# Altium schematic sheet Powerboard_Conector_1.SchDoc
size A4; CompanyName: Technische Hochschule Nürnberg Georg Simon Ohm; Organization: UltraZohm; Address1: Kesslerplatz 12; Address2: 90489 Nürnberg; Address3: GERMANY; DocumentNumber: 5; SheetNumber: 5; SheetTotal: 6; Website: www.ultrazohm.com
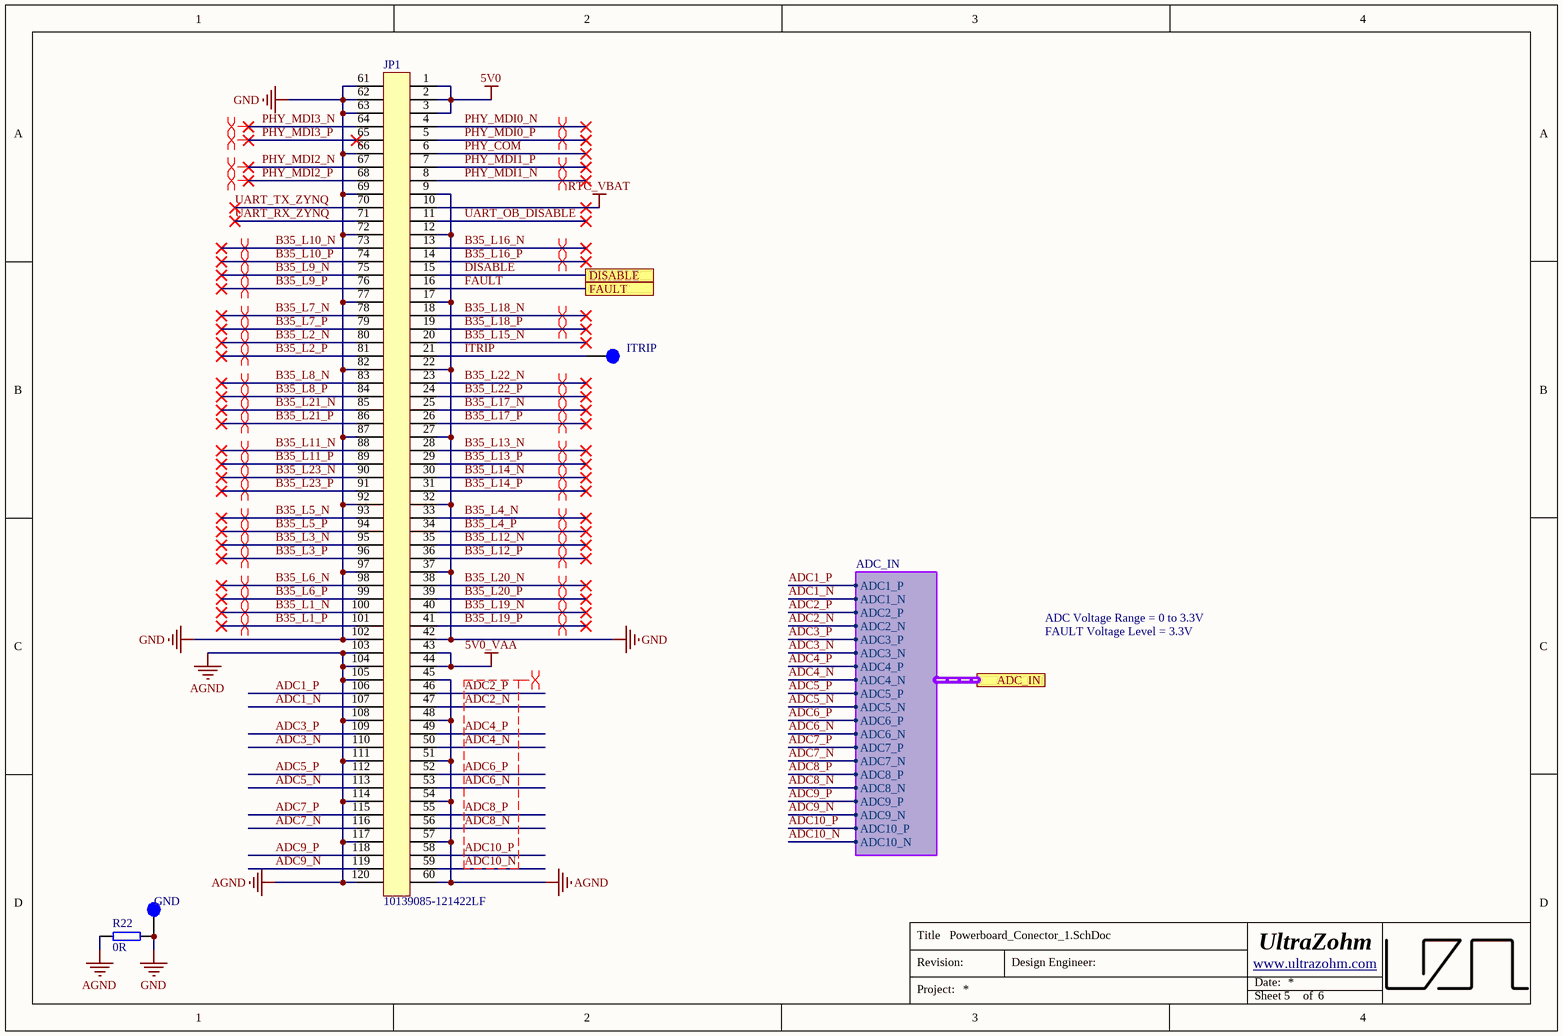
[diagram p0: Powerboard_Conector_1.SchDoc]

## Parts
GND  GND  [TP_1mm]  (value not drawn)  (no BOM)
ITRIP  ITRIP  [TP_1mm]  (value not drawn)  (no BOM)
JP1  10139085-121422LF  [10139085-121422LF]
R22  0R  [RESC1608X06N]

## Ports
ADC_IN (harness ADC_IN), DISABLE, FAULT

## Harnesses
ADC_IN: ADC1_P, ADC2_P, ADC3_P, ADC4_P, ADC5_P, ADC6_P, ADC7_P, ADC8_P, ADC9_P, ADC1_N, ADC2_N, ADC3_N, ADC4_N, ADC5_N, ADC6_N, ADC7_N, ADC8_N, ADC9_N, ADC10_P, ADC10_N

## Nets
5V0: JP1.1 JP1.2 JP1.3
5V0_VAA: JP1.43 JP1.44
AGND: JP1.45 JP1.48 JP1.51 JP1.54 JP1.57 JP1.60 JP1.103 JP1.104 JP1.105 JP1.108 JP1.111 JP1.114 JP1.117 JP1.120 R22.2
GND: GND.1 JP1.9 JP1.12 JP1.17 JP1.22 JP1.27 JP1.32 JP1.37 JP1.42 JP1.61 JP1.62 JP1.63 JP1.66 JP1.69 JP1.72 JP1.77 JP1.82 JP1.87 JP1.92 JP1.97 JP1.102 R22.1
RTC_VBAT: JP1.10
ADC1_N: JP1.107 ; port ADC_IN.ADC1_N
ADC1_P: JP1.106 ; port ADC_IN.ADC1_P
ADC2_N: JP1.47 ; port ADC_IN.ADC2_N
ADC2_P: JP1.46 ; port ADC_IN.ADC2_P
ADC3_N: JP1.110 ; port ADC_IN.ADC3_N
ADC3_P: JP1.109 ; port ADC_IN.ADC3_P
ADC4_N: JP1.50 ; port ADC_IN.ADC4_N
ADC4_P: JP1.49 ; port ADC_IN.ADC4_P
ADC5_N: JP1.113 ; port ADC_IN.ADC5_N
ADC5_P: JP1.112 ; port ADC_IN.ADC5_P
ADC6_N: JP1.53 ; port ADC_IN.ADC6_N
ADC6_P: JP1.52 ; port ADC_IN.ADC6_P
ADC7_N: JP1.116 ; port ADC_IN.ADC7_N
ADC7_P: JP1.115 ; port ADC_IN.ADC7_P
ADC8_N: JP1.56 ; port ADC_IN.ADC8_N
ADC8_P: JP1.55 ; port ADC_IN.ADC8_P
ADC9_N: JP1.119 ; port ADC_IN.ADC9_N
ADC9_P: JP1.118 ; port ADC_IN.ADC9_P
ADC10_N: JP1.59 ; port ADC_IN.ADC10_N
ADC10_P: JP1.58 ; port ADC_IN.ADC10_P
B35_L1_N: JP1.100
B35_L1_P: JP1.101
B35_L2_N: JP1.80
B35_L2_P: JP1.81
B35_L3_N: JP1.95
B35_L3_P: JP1.96
B35_L4_N: JP1.33
B35_L4_P: JP1.34
B35_L5_N: JP1.93
B35_L5_P: JP1.94
B35_L6_N: JP1.98
B35_L6_P: JP1.99
B35_L7_N: JP1.78
B35_L7_P: JP1.79
B35_L8_N: JP1.83
B35_L8_P: JP1.84
B35_L9_N: JP1.75
B35_L9_P: JP1.76
B35_L10_N: JP1.73
B35_L10_P: JP1.74
B35_L11_N: JP1.88
B35_L11_P: JP1.89
B35_L12_N: JP1.35
B35_L12_P: JP1.36
B35_L13_N: JP1.28
B35_L13_P: JP1.29
B35_L14_N: JP1.30
B35_L14_P: JP1.31
B35_L15_N: JP1.20
B35_L16_N: JP1.13
B35_L16_P: JP1.14
B35_L17_N: JP1.25
B35_L17_P: JP1.26
B35_L18_N: JP1.18
B35_L18_P: JP1.19
B35_L19_N: JP1.40
B35_L19_P: JP1.41
B35_L20_N: JP1.38
B35_L20_P: JP1.39
B35_L21_N: JP1.85
B35_L21_P: JP1.86
B35_L22_N: JP1.23
B35_L22_P: JP1.24
B35_L23_N: JP1.90
B35_L23_P: JP1.91
DISABLE: JP1.15 ; port DISABLE
FAULT: JP1.16 ; port FAULT
ITRIP: ITRIP.1 JP1.21
PHY_COM: JP1.6
PHY_MDI0_N: JP1.4
PHY_MDI0_P: JP1.5
PHY_MDI1_N: JP1.8
PHY_MDI1_P: JP1.7
PHY_MDI2_N: JP1.67
PHY_MDI2_P: JP1.68
PHY_MDI3_N: JP1.64
PHY_MDI3_P: JP1.65
UART_OB_DISABLE: JP1.11
UART_RX_ZYNQ: JP1.71
UART_TX_ZYNQ: JP1.70

## Layout directives
differential pair: ADC2_N, ADC2_P, ADC4_N, ADC4_P, ADC6_N, ADC6_P, ADC8_N, ADC8_P, ADC10_N, ADC10_P, B35_L1_N, B35_L1_P, B35_L2_N, B35_L2_P, B35_L3_N, B35_L3_P, B35_L4_N, B35_L4_P, B35_L5_N, B35_L5_P, B35_L6_N, B35_L6_P, B35_L7_N, B35_L7_P, B35_L8_N, B35_L8_P, B35_L9_N, B35_L9_P, B35_L10_N, B35_L10_P, B35_L11_N, B35_L11_P, B35_L12_N, B35_L12_P, B35_L13_N, B35_L13_P, B35_L14_N, B35_L14_P, B35_L16_N, B35_L16_P, B35_L17_N, B35_L17_P, B35_L18_N, B35_L18_P, B35_L19_N, B35_L19_P, B35_L20_N, B35_L20_P, B35_L21_N, B35_L21_P, B35_L22_N, B35_L22_P, B35_L23_N, B35_L23_P, PHY_MDI0_N, PHY_MDI0_P, PHY_MDI1_N, PHY_MDI1_P, PHY_MDI2_N, PHY_MDI2_P, PHY_MDI3_N, PHY_MDI3_P

## Notes on the sheet
- ADC Voltage Range = 0 to 3.3V
- FAULT Voltage Level = 3.3V
- Title
- Revision:
- Design Engineer:
- Date:
- Project:
- Sheet
- of

## Library data of the parts
GND ITRIP = TP_1mm: Testpoint 1mm; Created: 2018_06_25_AGeiger; Value: Testpoint 1mm
JP1 = 10139085-121422LF: Bergstack+ 0.8mm pich - 120pin B2B connector; ComponentLink1Description: Webpage; ComponentLink1URL: https://www.amphenol-icc.com/product-series/bergstak-plus-080mm-mezzanine.html; ComponentLink2Description: Datasheet; ComponentLink2URL: https://cdn.amphenol-icc.com/media/wysiwyg/files/documentation/datasheet/boardwiretoboard/bwb_bergstakplus_080mm_mezzanine.pdf; ComponentLink3Description: Component Drawing; ComponentLink3URL: https://cdn.amphenol-icc.com/media/wysiwyg/files/drawing/10139085.pdf; Part Number: 10139085-121422LF; Publisher: Amphenol ICC
R22 = R_0603: MPN: CRCW06031M00FKEAC; MF: Vishay / Dale; Tolerance: 1%; Value: 0R; Supplier 1: mouser; Supplier Part Number 1: 71-CRCW06031M00FKEAC; Package: 0603